# EAGLE design MinipHV4_0 (EAGLE 7.2.0)
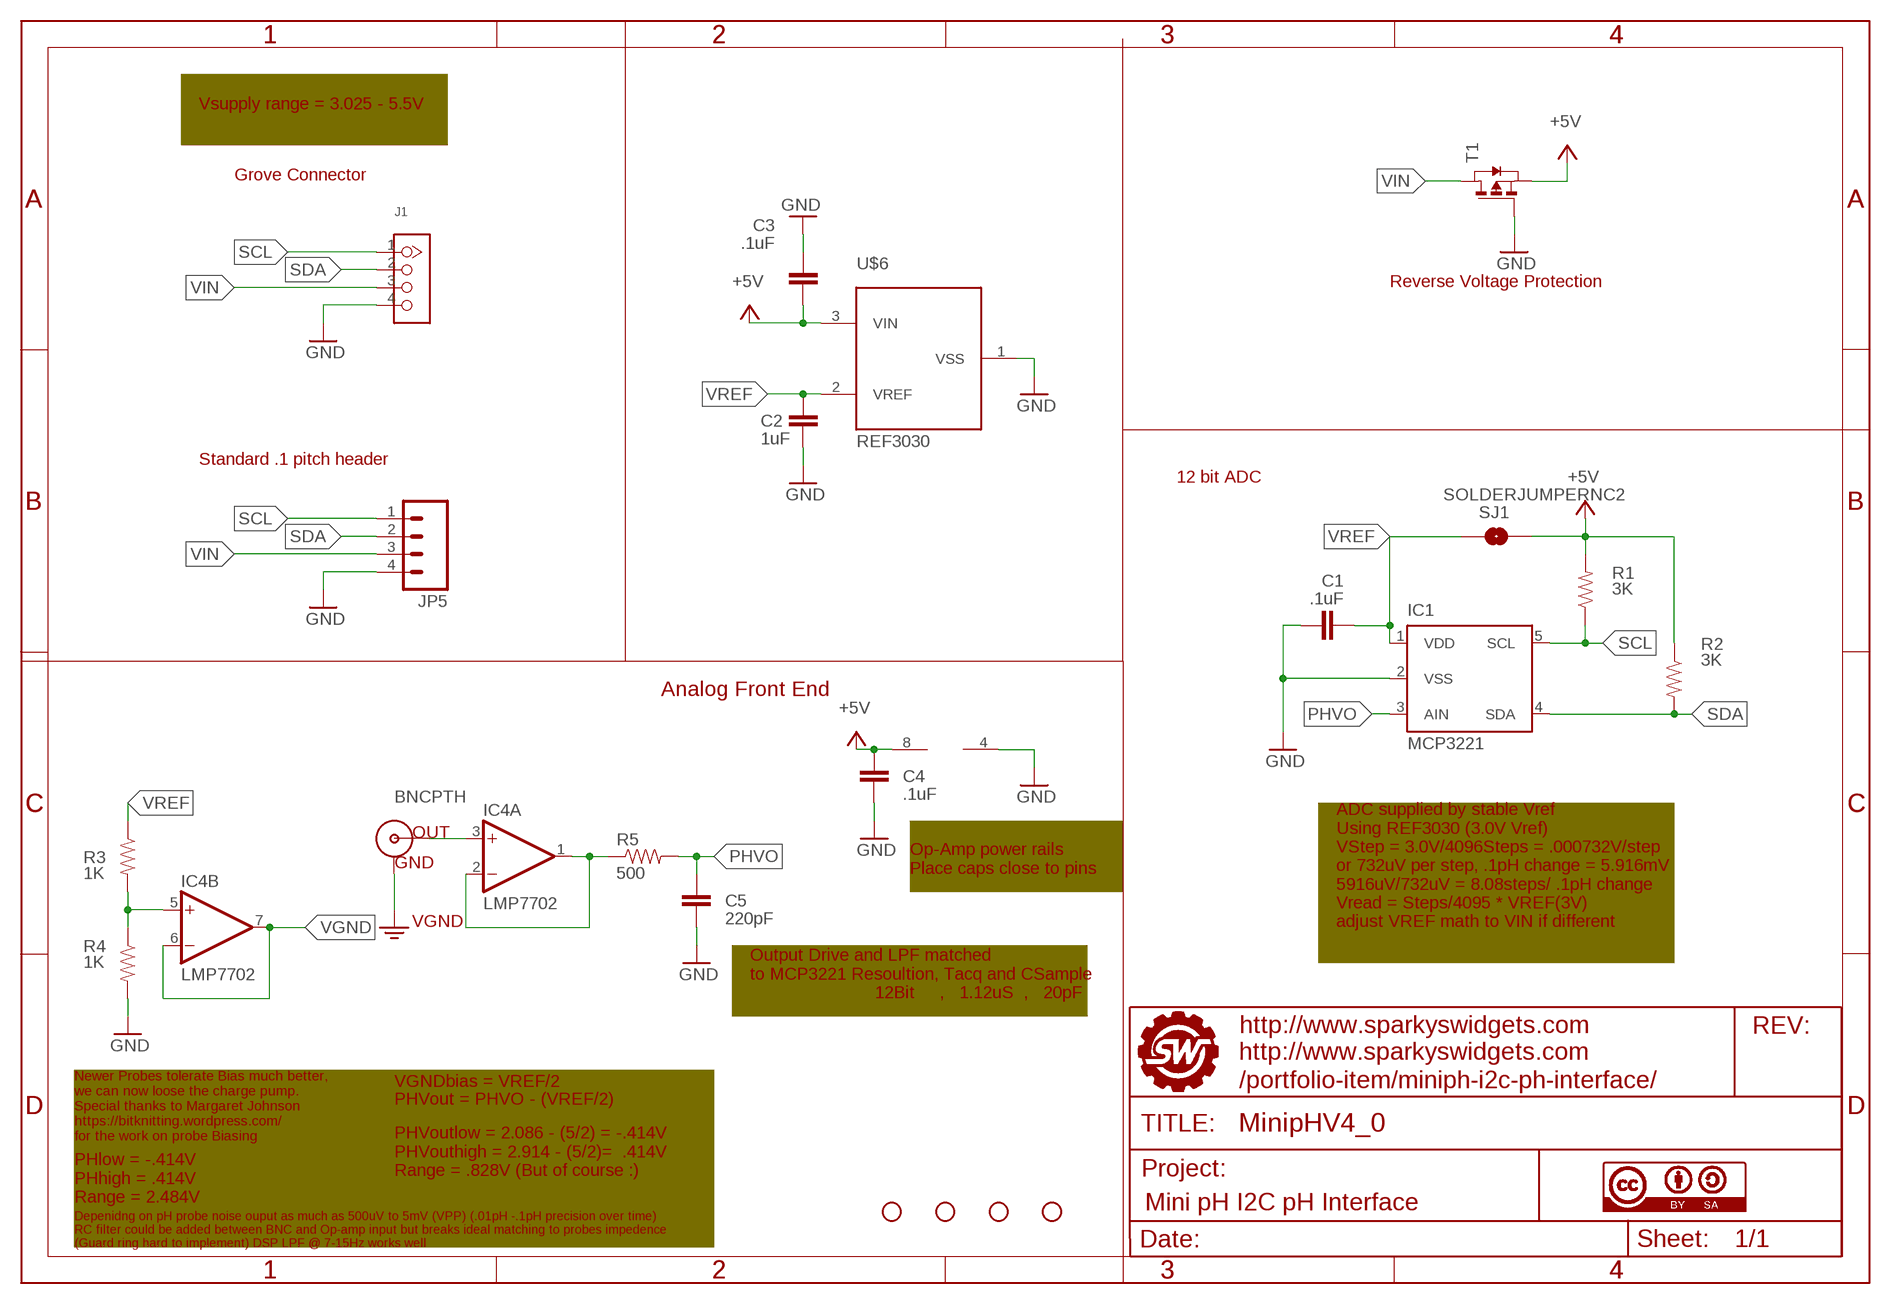
[diagram p0: schematic, sheet 1]

## Parts
C1  .1uF  CAP0805  [0805]
C2  1uF  CAP0805  [0805]
C3  .1uF  CAP0805  [0805]
C4  .1uF  CAP0805  [0805]
C5  220pF  CAP0805  [0805]
IC1  MCP3221  [SOT23-DBV]
IC4  LMP7702  LM358D  [SO08]
J1  TWIG-4P-2.0-2.0  [4P-2.0]
JP1  STAND-OFF  [STAND-OFF]
JP2  STAND-OFF  [STAND-OFF]
JP3  STAND-OFF  [STAND-OFF]
JP4  STAND-OFF  [STAND-OFF]
JP5  M04PTH  [1X04]
R1  3K  RESISTOR0805-RES  [0805]
R2  3K  RESISTOR0805-RES  [0805]
R3  1K  RESISTOR0805-RES  [0805]
R4  1K  RESISTOR0805-RES  [0805]
R5  500  RESISTOR0805-RES  [0805]
SJ1  SOLDERJUMPERNC2  [SJ_2S-NOTRACE]
T1  PMOSSOT23  [SOT-23]
U$2  BNCPTH  [BNC]
U$4  FRAME_MINIPH  [SWPCBLOGOWITHINFO]
U$5  CC-BY-SA  [CC-BY-SA]
U$6  REF3030  MCP1541  [SOT-23]

## Nets
+5V: C3.1 C4.1 IC4.8(P:V+) R1.2 R2.1 SJ1.2 T1.2(S) U$6.3(VIN)
GND: C1.1 C2.2 C3.2 C4.2 C5.2 IC1.2(VSS) IC4.4(P:V-) J1.4 JP5.4 R4.2 T1.3(G) U$6.1(VSS)
N$1: IC4.5(B:+IN) R3.2 R4.1
N$5: IC4.1(A:OUT) IC4.2(A:-IN) R5.1
PHVIN: IC4.3(A:+IN) U$2.S(OUT)
PHVO: C5.1 IC1.3(AIN) R5.2
SCL: IC1.5(SCL) J1.1 JP5.1 R1.1
SDA: IC1.4(SDA) J1.2 JP5.2 R2.2
VGND: IC4.6(B:-IN) IC4.7(B:OUT) U$2.GND ; supply symbol labelled GND2
VIN: J1.3 JP5.3 T1.1(D)
VREF: C1.2 C2.1 IC1.1(VDD) R3.1 SJ1.1 U$6.2(VREF)

## Notes on the sheet
- Vsupply range = 3.025 - 5.5V
- Grove Connector
- Reverse Voltage Protection
- Standard .1 pitch header
- 12 bit ADC
- Analog Front End
- Op-Amp power rails
  Place caps close to pins
- ADC supplied by stable Vref
  Using REF3030 (3.0V Vref)
  VStep = 3.0V/4096Steps = .000732V/step
  or 732uV per step, .1pH change = 5.916mV
  5916uV/732uV = 8.08steps/ .1pH change
  Vread = Steps/4095 * VREF(3V)
  adjust VREF math to VIN if different
- Output Drive and LPF matched
  to MCP3221 Resoultion, Tacq and CSample
                           12Bit     ,   1.12uS  ,   20pF
- VGNDbias = VREF/2
- PHVout = PHVO - (VREF/2)
- Newer Probes tolerate Bias much better,
  we can now loose the charge pump.
  Special thanks to Margaret Johnson
  https://bitknitting.wordpress.com/
  for the work on probe Biasing
- PHVoutlow = 2.086 - (5/2) = -.414V
  PHVouthigh = 2.914 - (5/2)=  .414V
  Range = .828V (But of course :)
- PHlow = -.414V
  PHhigh = .414V
  Range = 2.484V
- Depenidng on pH probe noise ouput as much as 500uV to 5mV (VPP) (.01pH -.1pH precision over time)
  RC filter could be added between BNC and Op-amp input but breaks ideal matching to probes impedence
  (Guard ring hard to implement) DSP LPF @ 7-15Hz works well

## Library data of the parts
C1-C5 = SparkysWidgets:CAP: Capacitor Standard 0603 ceramic capacitor, and 0.1" leaded capacitor.
IC1 = SparkysWidgets:MCP3221: 12 bit I2C ADC Low power 12-bit I2c ADC from MicroChip upto 22.3KSPS Source: http://ww1.microchip.com/downloads/en/DeviceDoc/21732b.pdf
IC4 = SparkysWidgets:LM358: OP AMP also LM158; LM258; LM2904 Source: http://cache.national.com/ds/LM/LM158.pdf
J1 = Connector:TWIG-4P-2.0
JP1-JP4 = SparkFun:STAND-OFF: Stand Off This is the mechanical footprint for a #4 phillips button head screw. Use the keepout ring to avoid running the screw head into surrounding components. SKU : PRT-00447
JP5 = SparkFun:M04: Header 4 Standard 4-pin 0.1" header. Use with straight break away headers (SKU : PRT-00116), right angle break away headers (PRT-00553), swiss pins (PRT-00743), machine pins (PRT-00117), and female headers (PRT-00115). Molex polarized connector foot print use with SKU : PRT-08231 with associated crimp pins and housings. 1MM SMD Version SKU: PRT-10208
R1-R5 = SparkysWidgets:RESISTOR: Resistor Basic schematic elements and footprints for 0603, 1206, and PTH resistors.
SJ1 = SparkFun:SOLDERJUMPER: Solder Jumper Standard SMD solder jumper. Used to automate production. Two varients : Normally Open and Normally Closed are the same, but have different paste layers. NC will have a large amount of paste and should jumper during reflow.
T1 = SparkysWidgets:PMOSSOT23: MOS FET
U$2 = SparkysWidgets:BNC: BNC Connector, Mouser Part# 5227161
U$4 = SW_ArtWork:FRAME_MINIPH: A4 Sparky's Widgets frame This is a standard A4 Frame, the Doc Field has been modified with our Logo and contains the license and extra project information!; PROJECT: Mini pH I2C pH Interface; URL1: /portfolio-item/miniph-i2c-ph-interface/; URLHOME: http://www.sparkyswidgets.com; URLPROJECT: http://www.sparkyswidgets.com
U$5 = SW_ArtWork:CC-BY-SA
U$6 = SparkysWidgets:MCP1541

## Board
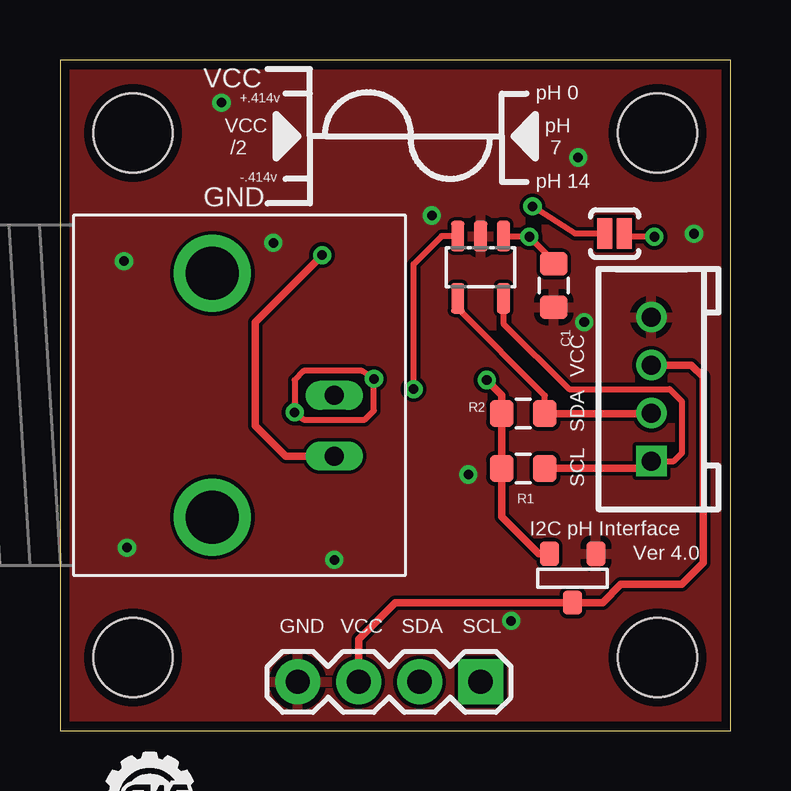
[diagram p1: board, top side]
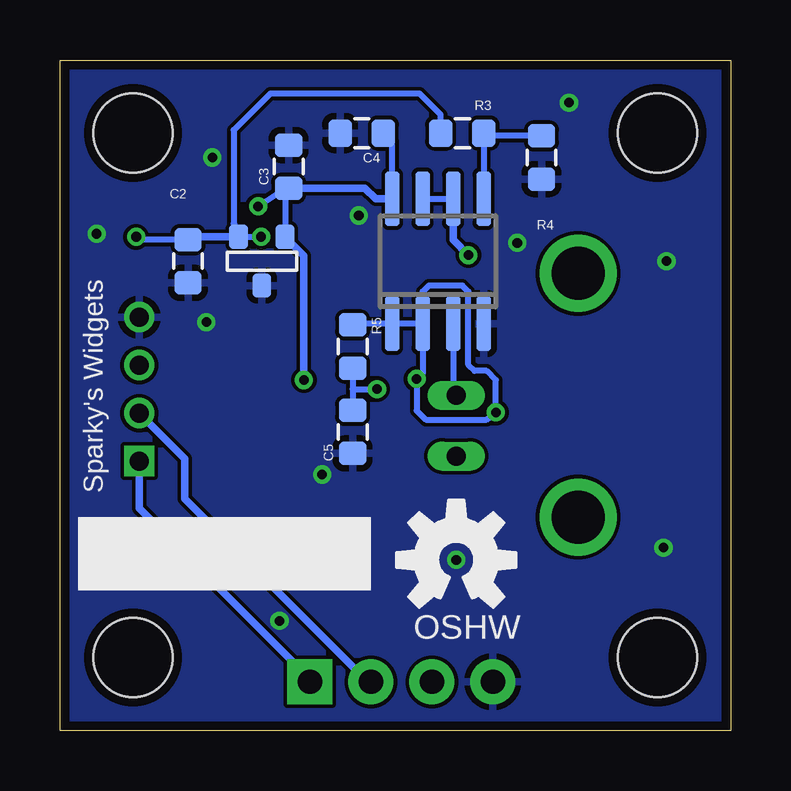
[diagram p2: board, bottom side, seen from below]

Size 27.94 x 27.94 mm. Coordinates in mm from the lower left corner, seen from the top.
Outline: 0,0 27.94,0 27.94,27.94 0,27.94 0,0
Copper layers (1*16): Top 0.0356mm / dielectric 1.5011mm / Bottom 0.0356mm
Design rules "LaenPCBOrder": minimum track width 6mil, minimum drill 13mil, track to track 6mil, track to pad 6mil, pad to pad 6mil, via to via 6mil, smd to smd 6mil, copper to edge 15mil, drill to drill 6mil, minimum pad ring 7mil, minimum via ring 7mil, stop-mask expansion 4mil, vias tented up to drill 0mil, thermal gap 10mil

### Footprints (pad centres in the part's own frame; a part is rotated, then mirrored left to right if it is on the bottom)
0805 = smd 0.984 x 1.143: 1 -0.9,0; 2 0.9,0
SOT23-DBV = smd 0.55 x 1.27: 1 -0.95,-1.3; 2 0,-1.3; 3 0.95,-1.3; 4 0.95,1.3; 5 -0.95,1.3
SO08 = smd 0.6 x 2.286: 1 -1.905,-2.6; 2 -0.635,-2.6; 3 0.635,-2.6; 4 1.905,-2.6; 5 1.905,2.6; 6 0.635,2.6; 7 -0.635,2.6; 8 -1.905,2.6
4P-2.0 = drill 0.8 pad 1.27 square: 1 -3,0 | drill 0.8 pad 1.27: 2 -1,0; 3 1,0; 4 3,0
STAND-OFF = hole 3.302: 0,0
1X04 = drill 1.016 pad 1.88 square: 1 0,0 | drill 1.016 pad 1.88: 2 2.54,0; 3 5.08,0; 4 7.62,0
SJ_2S-NOTRACE = smd 0.635 x 1.27: 1 -0.401,0; 2 0.413,0
SOT-23 = smd 0.787 x 1.016: 1 0.025,-1.016; 2 -0.94,1.016; 3 0.991,1.016
BNC = drill 2.2: 3 -5.08,5.08; 4 5.08,5.08 | drill 0.8 long: GND -2.54,0; S 0,0

### Placement (x,y rotation side)
C1  20.57,18.54 90 top
C2  22.61,19.56 270 bottom
C3  18.41,23.5 90 bottom
C4  15.37,24.89 180 bottom
C5  15.75,12.45 270 bottom
IC1  17.53,19.3 180 top
IC4  12.19,19.56 0 bottom
J1  24.64,14.22 90 top
JP1  3.05,3.05 0 top
JP2  24.89,3.05 0 top
JP3  3.05,24.89 0 top
JP4  24.89,24.89 0 top
JP5  17.53,2.03 180 top
R1  19.3,10.92 180 top
R2  19.3,13.21 0 top
R3  11.18,24.89 0 bottom
R4  7.87,23.88 270 bottom
R5  15.75,16 270 bottom
SJ1  23.11,20.7 180 top
T1  21.34,6.35 0 top
U$1  [SILK_ARROW]  9.65,24.64 90 top
U$2  11.43,13.97 90 top
U$3  [OSHW-LOGO-M]  11.43,7.11 0 bottom
U$4  1.78,-4.83 0 top  (outside the outline)
U$5  2.03,-10.92 0 top  (outside the outline)
U$6  19.56,19.56 0 bottom
U$7  [SILK_ARROW]  19.18,24.89 270 top

### Tracks (layer width: path | path; a pad name or v marks a point on that pad's centre or on a via)
+5V  (via drill 0.4)
  Top 0.254: SJ1.2 21.46,20.7 v19.68,21.84
  Top 0.305: T1.2 19.94,7.37 18.4,8.9 R1.2 R2.1 18.4,13.98 v17.78,14.61
  Bottom 0.254: IC4.8 14.1,24.39 C4.1 | v19.68,21.84 18.55,22.61 C3.1 18.53,22.48 18.53,20.61
  Bottom 0.305: v17.78,14.61 17.78,19.79 U$6.3 18.53,20.61 | C3.1 15.24,22.61 14.79,22.16 IC4.8
GND  (via drill 0.4)
  other vias: 2.79,7.62 11.43,7.11 8.89,20.32 15.49,21.46 17.02,10.67 21.84,17.02 6.73,26.16 2.67,19.56 21.59,23.88 18.8,4.57 26.42,20.7
  pour Top: -0.25,28.19 -0.25,-0.25 28.19,-0.25 28.19,28.19
  pour Bottom: -0.76,28.7 -0.76,-1.02 28.7,-0.76 28.7,28.7
N$1
  Bottom 0.254: R4.1 10.16,24.78 R3.2 10.28,23.25 10.41,23.11 10.41,22.29 IC4.5
N$5  (via drill 0.4)
  Top 0.254: v13.08,14.66 12.57,14.99 10.16,14.99 9.78,14.61 v9.78,13.26 10.16,12.95 12.7,12.95 13.08,13.34 v13.08,14.66
  Bottom 0.254: IC4.2 IC4.1 15.69,16.96 R5.1 | IC4.2 12.83,14.86 v13.08,14.66 13.08,13.34 12.7,12.95 10.16,12.95 v9.78,13.26 9.78,14.61 10.16,14.99 10.67,14.99 10.92,15.24 10.92,18.29 11.18,18.54 12.57,18.54 12.83,18.29 IC4.2
PHVIN
  Bottom 0.254: IC4.3 11.56,14.1 U$2.S
PHVO  (via drill 0.4)
  Top 0.254: v14.73,14.22 14.73,19.43 15.9,20.6 IC1.3
  Bottom 0.254: 15.75,14.22 C5.1 | R5.2 15.75,14.22 | 15.75,14.22 v14.73,14.22
SCL
  Top 0.254: IC1.5 18.48,16.96 21.21,14.22 25.4,14.22 25.91,13.72 25.91,11.56 25.57,11.22 J1.1
  Top 0.305: R1.1 24.34,10.92 J1.1
  Bottom 0.305: JP5.1 17.53,2.16 24.64,9.27 J1.1
SDA
  Top 0.254: IC1.4 16.58,17.59 20.2,13.96 R2.2
  Top 0.305: R2.2 24.62,13.21 J1.2
  Bottom 0.305: JP5.2 15.11,2.03 22.73,9.65 22.73,11.32 J1.2
VGND  (via drill 0.4)
  Top 0.305: v10.92,19.81 8.13,17.02 8.13,12.7 9.4,11.43 U$2.GND
  Bottom 0.254: IC4.7 IC4.6
  Bottom 0.305: IC4.6 11.56,20.45 v10.92,19.81
VIN
  Top 0.305: JP5.3 12.45,3.81 13.97,5.33 T1.1 22.61,5.33 23.37,6.1 25.91,6.1 26.8,6.99 26.8,14.73 26.3,15.22 J1.3
VREF  (via drill 0.4)
  Top 0.254: 18.51,20.57 v19.56,20.57 20.47,19.66 20.47,19.55 | v24.77,20.57 23.64,20.57 SJ1.1
  Top 0.305: 18.51,20.57 IC1.1 | 20.47,19.55 C1.2
  Bottom 0.254: R3.1 12.08,25.66 12.95,26.54 19.18,26.54 20.7,25.02 20.7,21.13 U$6.2 v19.56,20.57 | C2.1 24.65,20.46 v24.77,20.57
  Bottom 0.305: U$6.2 22.49,20.57 C2.1

### Text on the board
tPlace: VCC | +.414v | pH 0 | VCC / /2 | pH / 7 | -.414v | pH 14 | GND | VCC | SDA | SCL | I2C pH Interface | Ver 4.0 | GND | VCC | SDA | SCL
bPlace: Sparky's Widgets | OSHW